# Altium project 18f97j60.PrjPCB
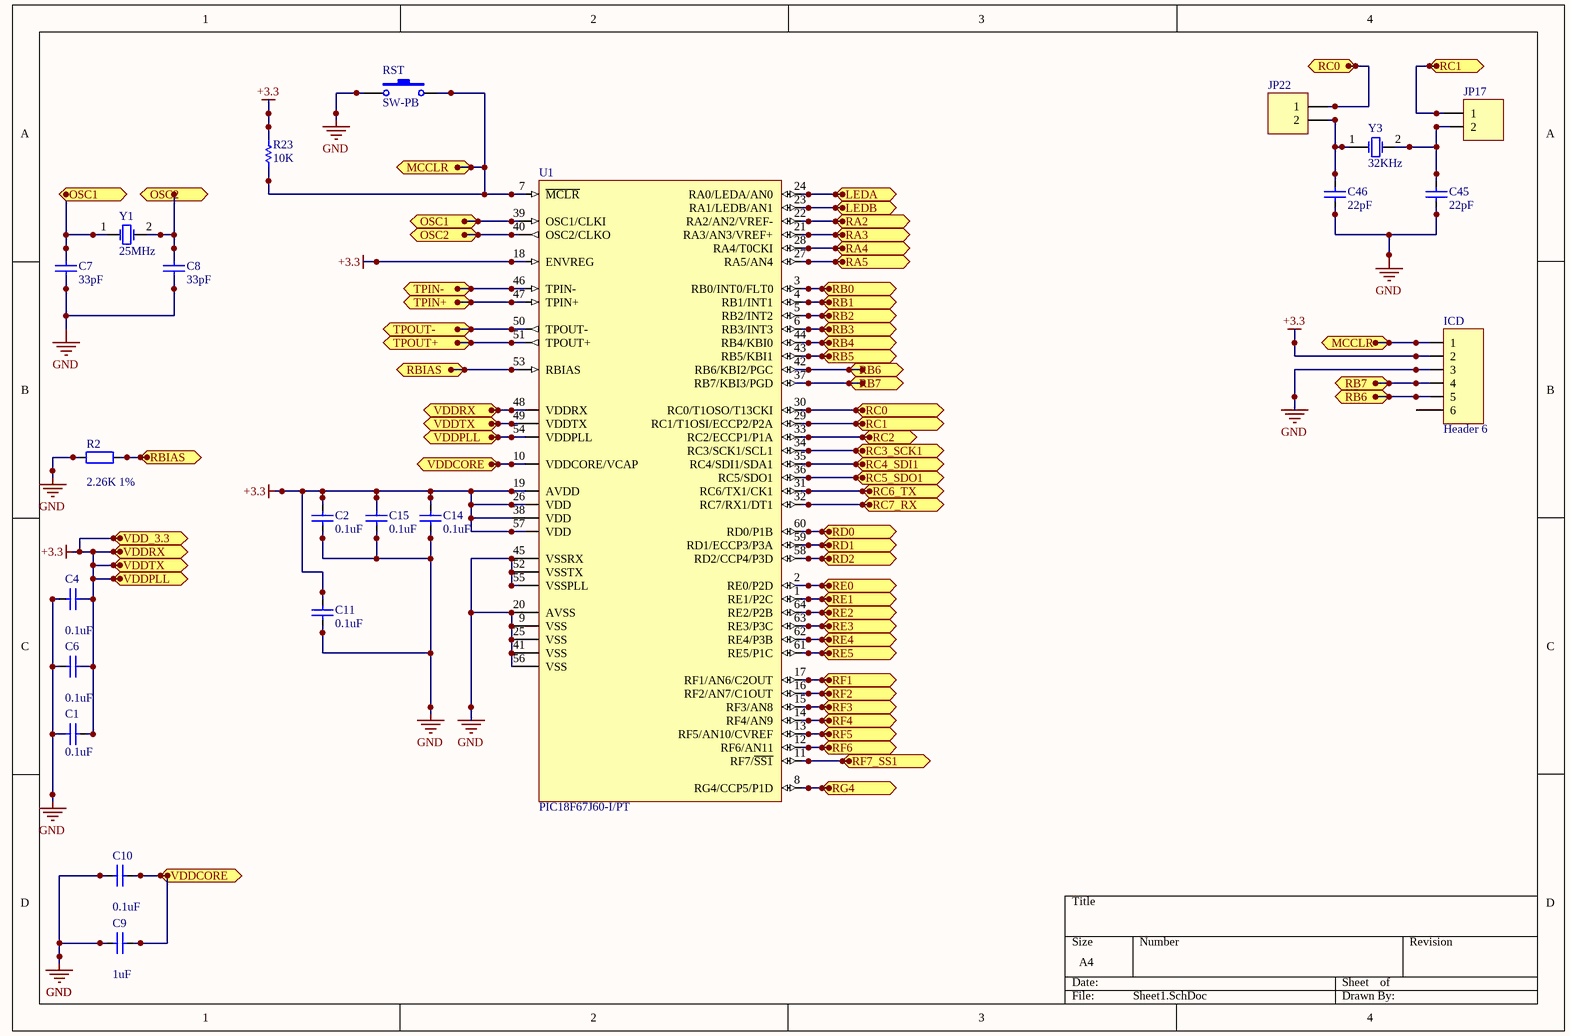
[diagram p0: Sheet1.SchDoc]
1 sheet, 22 parts. Net scope: flat (ports and power ports of the same name join across sheets).
Board file: PCB1.PcbDoc

## Sheet Sheet1.SchDoc
size A4

### Parts
C1  0.1uF  [CAPC2012L]
C2  0.1uF  [CAPC2012L]
C4  0.1uF  [CAPC2012L]
C6  0.1uF  [CAPC2012L]
C7  33pF  [CAPC2012L]
C8  33pF  [CAPC2012L]
C9  1uF  [CAPC2012L]
C10  0.1uF  [CAPC2012L]
C11  0.1uF  [CAPC2012L]
C14  0.1uF  [CAPC2012L]
C15  0.1uF  [CAPC2012L]
C45  22pF  [CAPC2012L]
C46  22pF  [CAPC2012L]
ICD  Header 6  [HDR1X6]
JP17  Header 2  [HDR1X2]  (value not drawn)
JP22  Header 2  [HDR1X2]  (value not drawn)
R2  2.26K 1%  [RESC2012L]
R23  10K  [RESC3216L]
RST  SW-PB  [SPST-2]
U1  PIC18F67J60-I/PT  [TQFP-PT64_L]
Y1  25MHz  [SPST-2]
Y3  32KHz  [SPST-2]

### Ports
LEDA, LEDB, MCCLR, OSC1, OSC2, RA2, RA3, RA4, RA5, RB0, RB1, RB2, RB3, RB4, RB5, RB6, RB7, RBIAS (in), RBIAS (out), RC0, RC1, RC2, RC3_SCK1, RC4_SDI1, RC5_SDO1, RC6_TX, RC7_RX, RD0, RD1, RD2, RE0, RE1, RE2, RE3, RE4, RE5, RF1, RF2, RF3, RF4, RF5, RF6, RF7_SS1, RG4, TPIN+, TPIN-, TPOUT+, TPOUT-, VDD_3.3, VDDCORE, VDDPLL, VDDRX, VDDTX

### Nets
+3.3: C1.2 C2.2 C4.2 C6.2 C11.2 C14.2 C15.2 ICD.2 R23.2 U1.18(ENVREG) U1.19(AVDD) U1.26(VDD) U1.38(VDD) U1.48(VDDRX) U1.49(VDDTX) U1.54(VDDPLL) U1.57(VDD) ; port VDDRX, port VDDTX, port VDDPLL, port VDD_3.3
GND: C1.1 C2.1 C4.1 C6.1 C7.1 C8.1 C9.1 C10.1 C11.1 C14.1 C15.1 C45.1 C46.1 ICD.3 R2.1 RST.1 U1.9(VSS) U1.20(AVSS) U1.25(VSS) U1.41(VSS) U1.45(VSSRX) U1.52(VSSTX) U1.55(VSSPLL) U1.56(VSS)
NetC7_2: C7.2 Y1.1(OSC1)
NetC8_2: C8.2 Y1.2(OSC2)
NetC9_2: C9.2 C10.2 U1.10(VDDCORE/VCAP) ; port VDDCORE
NetC45_2: C45.2 JP17.2 Y3.2(OSC2)
NetC46_2: C46.2 JP22.2 Y3.1(OSC1)
NetICD_1: ICD.1 R23.1 RST.2 U1.7(~{MCLR}) ; port MCCLR
NetICD_4: ICD.4 U1.37(RB7/KBI3/PGD) ; port RB7
NetICD_5: ICD.5 U1.42(RB6/KBI2/PGC) ; port RB6
NetJP17_1: JP17.1 U1.29(RC1/T1OSI/ECCP2/P2A) ; port RC1
NetJP22_1: JP22.1 U1.30(RC0/T1OSO/T13CKI) ; port RC0
NetR2_2: R2.2 U1.53(RBIAS) ; port RBIAS
NetU1_1: U1.1(RE1/P2C) ; port RE1
NetU1_2: U1.2(RE0/P2D) ; port RE0
NetU1_3: U1.3(RB0/INT0/FLT0) ; port RB0
NetU1_4: U1.4(RB1/INT1) ; port RB1
NetU1_5: U1.5(RB2/INT2) ; port RB2
NetU1_6: U1.6(RB3/INT3) ; port RB3
NetU1_8: U1.8(RG4/CCP5/P1D) ; port RG4
NetU1_11: U1.11(RF7/~{SS1}) ; port RF7_SS1
NetU1_12: U1.12(RF6/AN11) ; port RF6
NetU1_13: U1.13(RF5/AN10/CVREF) ; port RF5
NetU1_14: U1.14(RF4/AN9) ; port RF4
NetU1_15: U1.15(RF3/AN8) ; port RF3
NetU1_16: U1.16(RF2/AN7/C1OUT) ; port RF2
NetU1_17: U1.17(RF1/AN6/C2OUT) ; port RF1
NetU1_21: U1.21(RA3/AN3/VREF+) ; port RA3
NetU1_22: U1.22(RA2/AN2/VREF-) ; port RA2
NetU1_23: U1.23(RA1/LEDB/AN1) ; port LEDB
NetU1_24: U1.24(RA0/LEDA/AN0) ; port LEDA
NetU1_27: U1.27(RA5/AN4) ; port RA5
NetU1_28: U1.28(RA4/T0CKI) ; port RA4
NetU1_31: U1.31(RC6/TX1/CK1) ; port RC6_TX
NetU1_32: U1.32(RC7/RX1/DT1) ; port RC7_RX
NetU1_33: U1.33(RC2/ECCP1/P1A) ; port RC2
NetU1_34: U1.34(RC3/SCK1/SCL1) ; port RC3_SCK1
NetU1_35: U1.35(RC4/SDI1/SDA1) ; port RC4_SDI1
NetU1_36: U1.36(RC5/SDO1) ; port RC5_SDO1
NetU1_39: U1.39(OSC1/CLKI) ; port OSC1
NetU1_40: U1.40(OSC2/CLKO) ; port OSC2
NetU1_43: U1.43(RB5/KBI1) ; port RB5
NetU1_44: U1.44(RB4/KBI0) ; port RB4
NetU1_46: U1.46(TPIN-) ; port TPIN-
NetU1_47: U1.47(TPIN+) ; port TPIN+
NetU1_50: U1.50(TPOUT-) ; port TPOUT-
NetU1_51: U1.51(TPOUT+) ; port TPOUT+
NetU1_58: U1.58(RD2/CCP4/P3D) ; port RD2
NetU1_59: U1.59(RD1/ECCP3/P3A) ; port RD1
NetU1_60: U1.60(RD0/P1B) ; port RD0
NetU1_61: U1.61(RE5/P1C) ; port RE5
NetU1_62: U1.62(RE4/P3B) ; port RE4
NetU1_63: U1.63(RE3/P3C) ; port RE3
NetU1_64: U1.64(RE2/P2B) ; port RE2

Not connected (* = marked no-connect by the designer): ICD 6

### Library data of the parts
C1 C45 C46 = Cap Semi: Capacitor (Semiconductor SIM Model); Published: 8-Jun-2000; LatestRevisionDate: 29-May-2009; LatestRevisionNote: IPC-7351 Footprint Added.; PackageReference: C1206; Publisher: Altium Limited; PackageDescription: Chip Capacitor
  C1: Value: 0.1uF
  C45 C46: Value: 22pF
C2 C4 C6-C11 C14 C15 = Cap: Capacitor; Published: 8-Jun-2000; LatestRevisionDate: 17-Jul-2002; LatestRevisionNote: Re-released for DXP Platform.; PackageReference: RAD-0.3; Publisher: Altium Limited
  C2 C4 C6 C10 C11 C14 C15: Value: 0.1uF
  C7 C8: Value: 33pF
  C9: Value: 1uF
ICD = Header 6: Header, 6-Pin; LatestRevisionDate: 17-Jul-2002; LatestRevisionNote: Re-released for DXP Platform.; Publisher: Altium Limited
JP17 JP22 = Header 2: Header, 2-Pin; LatestRevisionDate: 17-Jul-2002; LatestRevisionNote: Re-released for DXP Platform.; Publisher: Altium Limited
R2 = Res2: Resistor; Published: 8-Jun-2000; LatestRevisionDate: 17-Jul-2002; LatestRevisionNote: Re-released for DXP Platform.; PackageReference: AXIAL-0.4; Publisher: Altium Limited; Value: 2.26K 1%
R23 = Res Semi: Semiconductor Resistor; Published: 8-Jun-2000; LatestRevisionDate: 17-Jul-2002; LatestRevisionNote: Re-released for DXP Platform.; PackageReference: AXIAL-0.5; Publisher: Altium Limited; Value: 10K
RST = SW-PB: Switch; Published: 24-Mar-1999; LatestRevisionDate: 17-Jul-2002; LatestRevisionNote: Re-released for DXP Platform.; PackageReference: SPST-2; Publisher: Altium Limited
U1 = PIC18F67J60-I/PT: High Performance, 1-Mbit Flash Microcontroller with Ethernet, 128K Flash, 64-Pin TQFP, Industrial Temperature Range; FirstPublished: 29-Jan-2009; LatestRevisionDate: 02-Dec-2009; LatestRevisionNote: Updated to datasheet revision E, Oct-2009; DatasheetVersion: revE, Oct-2009; PackageVersion: revBB, Aug-2009; PackageReference: TQFP-PT64; Publisher: Altium Limited; PackageDescription: 64-Lead Thin Plastic Quad Flat Pack (PT) - 10x10x1mm Body, 2.00mm [TQFP]; Supplier 1: Digi-Key; Supplier Part Number 1: PIC18F67J60-I/PT-ND; Supplier 2: Farnell; Supplier Part Number 2: 1332285; Supplier 3: Newark; Supplier Part Number 3: 56K7302; Code_JEDEC: MS-026; ComponentLink1Description: Datasheet; ComponentLink1URL: http://ww1.microchip.com/downloads/en/DeviceDoc/39762e.pdf; ComponentLink2Description: Packaging Specification; ComponentLink2URL: http://www.microchip.com/stellent/groups/techpub_sg/documents/packagingspec/en012702.pdf; ComponentLink3Description: Microchip.com Home; ComponentLink3URL: http://www.microchip.com/
Y1 Y3 = XTAL: Crystal Oscillator; Published: 8-Jun-2000; LatestRevisionDate: 17-Jul-2002; LatestRevisionNote: Re-released for DXP Platform.; PackageReference: R38; Publisher: Altium Limited